# Altium schematic sheet Charger.SchDoc
size A
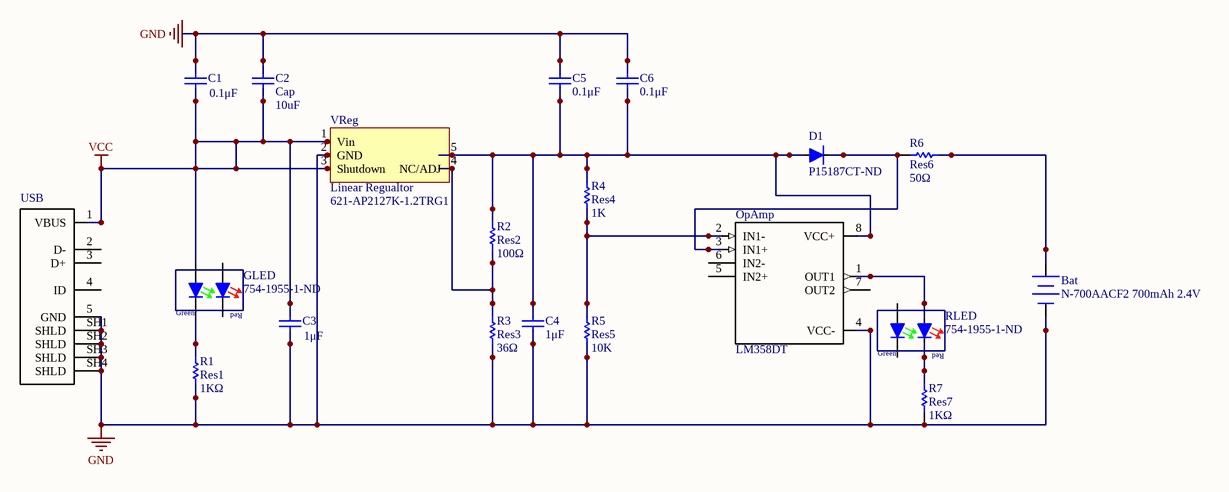
[diagram p0: Charger.SchDoc]

## Parts
Bat  N-700AACF2 700mAh 2.4V  [*FCI_10118193-0001LF_10118193-0001LF(Primary)]
C1  0.1μF  [CAPC1608N(0603")]
C2  Cap  value 10uF  [CAPC2012N(0805")]
C3  1μF  [CAPC1608N(0603")]
C4  1μF  [CAPC1608N(0603")]
C5  0.1μF  [CAPC1608N(0603")]
C6  0.1μF  [CAPC1608N(0603")]
D1  Supplier Part Number 1: P15187CT-ND  [SODFL535X110-2N]  (hidden comment: DA2S10400L, SOD323F / SC-90)  (no BOM)
GLED  Supplier Part Number 1: 754-1955-1-ND  [LED0603_DUAL]
OpAmp  LM358DT  [*SOIC127P600X175-8N]
R1  Res1  value 1KΩ  [RESC1608N(0603")]
R2  Res2  value 100Ω  [RESC1608N(0603")]
R3  Res3  value 36Ω  [RESC1608N(0603")]
R4  Res4  value 1K  [RESC1608N(0603")]
R5  Res5  value 10K  [RESC1608N(0603")]
R6  Res6  value 50Ω  [RESC1608N(0603")]
R7  Res7  value 1KΩ  [RESC1608N(0603")]
RLED  Supplier Part Number 1: 754-1955-1-ND  [LED0603_DUAL]
USB  1734035-3  [*TE_1734035-3_1734035-3(Primary)]  (value not drawn)
VReg  Linear Regualtor  [621-AP2127K-1.2TRG1]

## Nets
GND: Bat.2(-) C1.2(Cathode) C2.2 C3.1(Anode) C4.1(Anode) C5.2(Cathode) C6.2(Cathode) OpAmp.4(VCC-) R1.1 R3.1 R5.1 R7.1 USB.5(GND) USB.SH1(SHLD) USB.SH2(SHLD) USB.SH3(SHLD) USB.SH4(SHLD) VReg.2(GND)
VCC: C1.1(Anode) C2.1 C3.2(Cathode) GLED.1(Cathode) USB.1(VBUS) VReg.1(Vin) VReg.3(Shutdown)
NetBat_1: Bat.1(+) R6.2
NetC4_2: C4.2(Cathode) C5.1(Anode) C6.1(Anode) D1.1(Anode) OpAmp.8(VCC+) R2.2 R4.2 VReg.5(Vout)
NetD1_2: D1.2(Cathode) OpAmp.3(IN1+) R6.1
NetGLED_2: GLED.2(Anode) R1.2
NetOpAmp_1: OpAmp.1(OUT1) RLED.4(Cathode)
NetOpAmp_2: OpAmp.2(IN1-) R4.1 R5.2
NetR2_1: R2.1 R3.2 VReg.4(NC/ADJ)
NetR7_2: R7.2 RLED.3(Anode)

Not connected (* = marked no-connect by the designer): GLED 3(Anode) 4(Cathode); OpAmp 5(IN2+) 6(IN2-) 7(OUT2); RLED 1(Cathode) 2(Anode); USB 2(D-) 3(D+) 4(ID)

## Library data of the parts
Bat = Battery: Multicell Battery; Published: 24-Mar-1999; LatestRevisionDate: 17-Jul-2002; LatestRevisionNote: Re-released for DXP Platform.; PackageReference: BAT-2; Publisher: Altium Limited; PackageDescription: Battery; 2 Leads
C1 C5 C6 = 0.1uF 16V 0603 SMD, Ceramic: Capacitor, Ceramic, 16V, +/- 10%, 0603 SMD, X7R; Published: 16-04-26; Publisher: AUVic; PackageDescription: Chip Capacitor; Value: 0.1μF; Created By: Andy Bates; Supplier 1: Digi-Key; Supplier Part Number 1: 1276-1005-1-ND
C2 = Cap: Capacitor; Published: 8-Jun-2000; LatestRevisionDate: 17-Jul-2002; LatestRevisionNote: Re-released for DXP Platform.; PackageReference: RAD-0.3; Publisher: Altium Limited; PackageDescription: Radial Cap, Thru-Hole; 2 Leads; 0.3 in Pin Spacing
C3 C4 = 1uF 25V 0603 SMD, Ceramic: Capacitor, Ceramic, 25V, +/- 10%, 0603 SMD, X5R; MFG: Murata-Electronics-North-America; MFG#: GRM188R61E105KA12D; Published: 16-06-27; Publisher: AUVic; PackageDescription: Chip Capacitor; Value: 1μF; Created By: Andy Bates; Supplier 1: Digi-Key; Supplier Part Number 1: 490-3897-1-ND
D1 = DA2S10400L, SOD323F / SC-90: Forward Voltage Drop: 1.1V; Created By: Andy Bates; Publisher: AUVic; Date Created: 2016-09-08; Supplier 1: Digi-Key
GLED RLED = LED, 0603 (1608), Red/Green, Clear: Colour 1: Red; Colour 2: Green; Created By: Ashwin Sira; Supplier 1: Digi-Key
OpAmp = LM358DT: LM358 Series 30 V 1.1 MHz Low Power Dual Operational Amplifier - SOIC-8; MF: STMicroelectronics; Package: SOIC-8 STMicroelectronics; SnapEDA_Link: https://www.snapeda.com/parts/LM358DT/STMicroelectronics/view-part/?ref=snap; Price: None; Availability: Unavailable; MP: LM358DT; Value: *
R1-R7 = Res1: Resistor; Published: 8-Jun-2000; LatestRevisionDate: 17-Jul-2002; LatestRevisionNote: Re-released for DXP Platform.; PackageReference: AXIAL-0.3; Publisher: Altium Limited; PackageDescription: Axial Device, Thru-Hole; 2 Leads; 0.3 in Pin Spacing
USB = 1734035-3: Conn Mini USB 2.0 Type B RCP 5 POS 0.8mm Solder RA SMD 5 Terminal 1 Port T/R; MF: TE Connectivity; Package: None; EU_RoHS_Compliance: Compliant; TE_purchase_URL: https://www.te.com/usa-en/product-1734035-3.html?te_bu=Cor&te_type=disp&te_campaign=seda_glo_cor-seda-global-disp-prtnr-fy19-seda-model-bom-cta_sma-317_1&elqCampaignId=32493; MP: 1734035-3; Price: None; SnapEDA_Link: https://www.snapeda.com/parts/1734035-3/TE%20Connectivity%20AMP%20Connectors/view-part/?ref=snap; Availability: Unavailable; Value: *
VReg = Linear Regualtor: Supplier 1: Mouser; Supplier Part Number 1: 621-AP2127K-1.2TRG1